# EAGLE design CK-7103_AV2_Breakout (EAGLE 9.6.2)
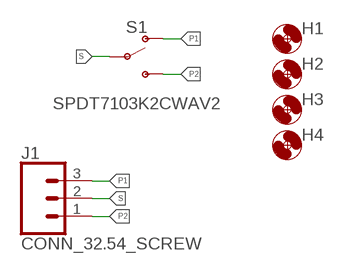
[diagram p0: schematic, sheet 1]

## Parts
H1  MOUNTING_HOLE4_NP  [4_40]
H2  MOUNTING_HOLE4_NP  [4_40]
H3  MOUNTING_HOLE4_NP  [4_40]
H4  MOUNTING_HOLE4_NP  [4_40]
J1  CONN_32.54_SCREW  [1X03_SCREW]
S1  SPDT7103K2CWAV2  [7103K2CWAV2]

## Nets
P1: J1.3 S1.1(O)
P2: J1.1 S1.3(S)
S: J1.2 S1.2(P)

## Library data of the parts
H1-H4 = bschulz:MOUNTING_HOLE: Genaric Mechanical Mounting Hole Hole diameter based on max body diameter + 15% Keepout ring is for diameter of socket cap screw (minimum required clearance) TPlace ring is for diameter of pan head screw (recomended clearance) Specifications: Socket Cap <http://fastener-express.com/fastener-technical/SocketscapSS-Alloy.pdf> Button Head Socket Cap <http://fastener-express.com/fastener-technical/Button-Socket-alloy.pdf> Pan Head <http://fastener-express.com/fastener-technical/pan-machine-Screws.pdf>; DIGIKEY: DNP; MF: N/A; MPN: DNP
J1 = bschulz:CONN_3: Genaric 3 terminal header Digikey 2.54_SCREW <https://www.digikey.com/product-detail/en/on-shore-technology-inc/OSTVN03A150/ED10562-ND/1588863> 3.5_SCREW <https://www.digikey.com/product-detail/en/on-shore-technology-inc/OSTTE030161/ED2636-ND/614585>; DIGIKEY: ED10562-ND; MF: On Shore; MPN: OSTVN03A150
S1 = bschulz:SPDT: Genaric SPDT switch; DIGIKEY: 7103K2CWAV2BE-ND; MF: C&K; MPN: 7103K2CWAV2BE

## Board
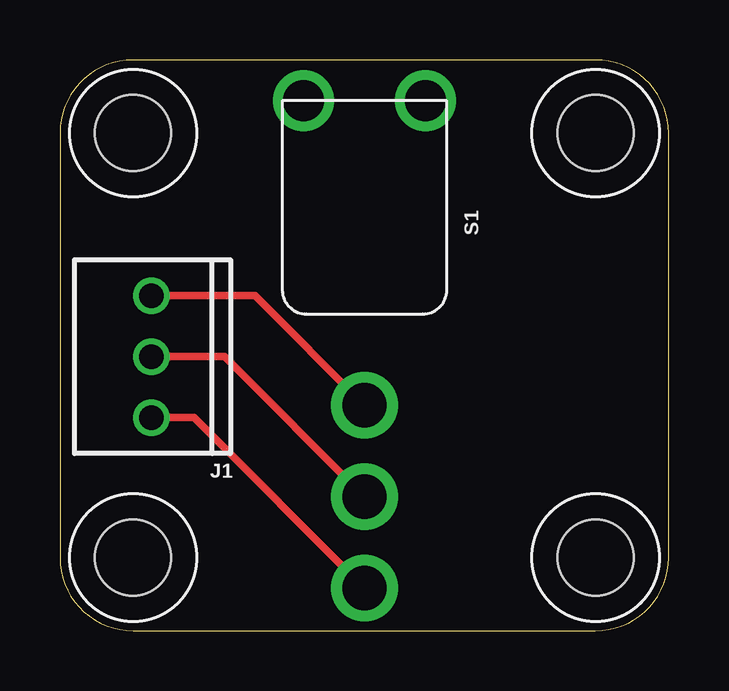
[diagram p1: board, top side]

Size 25.38 x 23.8 mm. Coordinates in mm from the lower left corner, seen from the top.
Outline: 22.33,23.8 3.05,23.8 arc90 0,20.75 0,3.05 arc90 3.05,0 22.33,0 arc90 25.38,3.05 25.38,20.75 arc90 22.33,23.8
Copper layers (1*16): Top 0.035559375mm / dielectric 1.6mm / Bottom 0.035559375mm
Design rules "oshpark-2layer": minimum track width 6mil, minimum drill 10mil, track to track 6mil, track to pad 6mil, pad to pad 6mil, via to via 6mil, smd to smd 6mil, copper to edge 15mil, drill to drill 6mil, minimum pad ring 5mil, minimum via ring 5mil, stop-mask expansion 2.5mil, vias tented up to drill 0mil, thermal gap 10mil

### Footprints (pad centres in the part's own frame; a part is rotated, then mirrored left to right if it is on the bottom)
4_40 = hole 3.175: 0,0
1X03_SCREW = drill 1.016: 1 -2.54,0; 2 0,0; 3 2.54,0
7103K2CWAV2 = drill 1.85: 1 0,12.7; 2 0,16.51; 3 0,20.32 | drill 1.7: BODY@1 -2.54,0; BODY@2 2.54,0

### Placement (x,y rotation side)
H1  3.05,20.75 0 top
H2  3.05,3.05 0 top
H3  22.33,3.05 0 top
H4  22.33,20.75 0 top
J1  3.81,11.43 90 top
S1  12.7,22.1 180 top

### Tracks (layer width: path | path; a pad name or v marks a point on that pad's centre or on a via)
P1
  Top 0.305: J1.3 8.13,13.97 S1.1
P2
  Top 0.305: J1.1 5.59,8.89 S1.3
S
  Top 0.305: J1.2 6.86,11.43 S1.2

### Text on the board
tDocu: Break44 / C&K-7103_AV2 / Breakout / B. Schulz